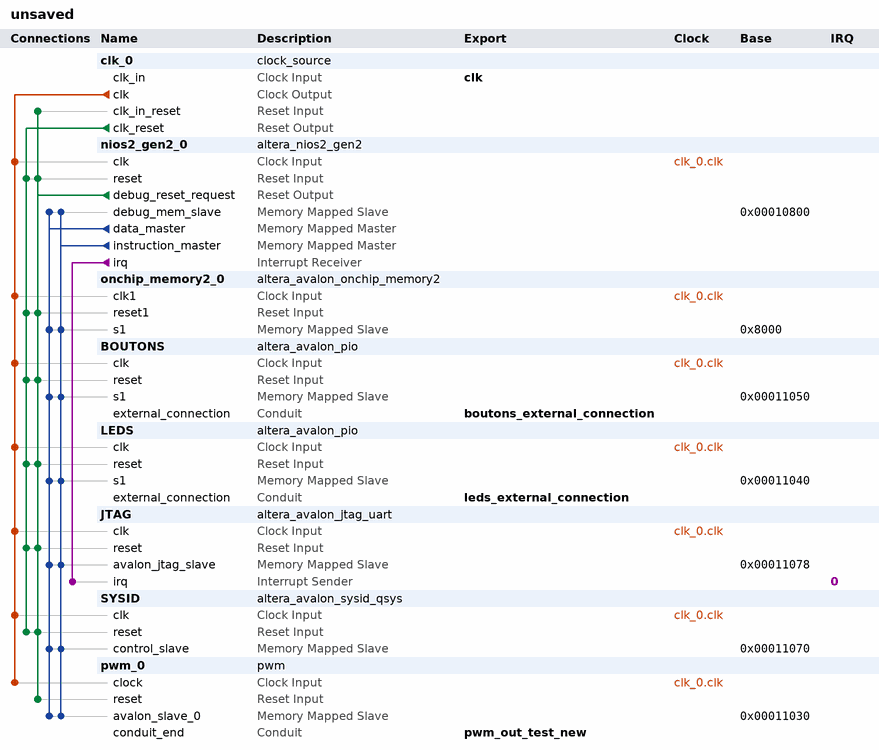
[diagram p0: system contents]
# Platform Designer (Qsys) system unsaved, Cyclone IV E EP4CE22F17C6
# Parameters at their usual value, and those the tool derives, are not listed.
package require -exact qsys 18.1
create_system unsaved
set_project_property DEVICE_FAMILY {Cyclone IV E}
set_project_property DEVICE EP4CE22F17C6

add_instance clk_0 clock_source 18.1
set_instance_parameter_value clk_0 clockFrequency 50000000

add_instance nios2_gen2_0 altera_nios2_gen2 18.1
set_instance_parameter_value nios2_gen2_0 dcache_size 2048
set_instance_parameter_value nios2_gen2_0 exceptionSlave onchip_memory2_0.s1
set_instance_parameter_value nios2_gen2_0 icache_size 4096
set_instance_parameter_value nios2_gen2_0 impl Tiny
set_instance_parameter_value nios2_gen2_0 resetSlave onchip_memory2_0.s1

add_instance onchip_memory2_0 altera_avalon_onchip_memory2 18.1
set_instance_parameter_value onchip_memory2_0 dataWidth 32
set_instance_parameter_value onchip_memory2_0 dualPort false
set_instance_parameter_value onchip_memory2_0 initMemContent true
set_instance_parameter_value onchip_memory2_0 initializationFileName onchip_mem.hex
set_instance_parameter_value onchip_memory2_0 memorySize 20480

add_instance BOUTONS altera_avalon_pio 18.1
set_instance_parameter_value BOUTONS direction Input
set_instance_parameter_value BOUTONS width 2

add_instance LEDS altera_avalon_pio 18.1
set_instance_parameter_value LEDS direction Output
set_instance_parameter_value LEDS width 8

add_instance JTAG altera_avalon_jtag_uart 18.1
set_instance_parameter_value JTAG simInteractiveOptions NO_INTERACTIVE_WINDOWS

add_instance SYSID altera_avalon_sysid_qsys 18.1
set_instance_parameter_value SYSID id 0

add_instance pwm_0 pwm 1.0

# connections
add_connection clk_0.clk BOUTONS.clk clock
add_connection clk_0.clk JTAG.clk clock
add_connection clk_0.clk LEDS.clk clock
add_connection clk_0.clk nios2_gen2_0.clk clock
add_connection clk_0.clk onchip_memory2_0.clk1 clock
add_connection clk_0.clk pwm_0.clock clock
add_connection clk_0.clk SYSID.clk clock
add_connection clk_0.clk_reset BOUTONS.reset reset
add_connection clk_0.clk_reset JTAG.reset reset
add_connection clk_0.clk_reset LEDS.reset reset
add_connection clk_0.clk_reset nios2_gen2_0.reset reset
add_connection clk_0.clk_reset onchip_memory2_0.reset1 reset
add_connection clk_0.clk_reset SYSID.reset reset
add_connection nios2_gen2_0.debug_reset_request BOUTONS.reset reset
add_connection nios2_gen2_0.debug_reset_request clk_0.clk_in_reset reset
add_connection nios2_gen2_0.debug_reset_request JTAG.reset reset
add_connection nios2_gen2_0.debug_reset_request LEDS.reset reset
add_connection nios2_gen2_0.debug_reset_request nios2_gen2_0.reset reset
add_connection nios2_gen2_0.debug_reset_request onchip_memory2_0.reset1 reset
add_connection nios2_gen2_0.debug_reset_request pwm_0.reset reset
add_connection nios2_gen2_0.debug_reset_request SYSID.reset reset
add_connection nios2_gen2_0.data_master BOUTONS.s1 avalon
set_connection_parameter_value nios2_gen2_0.data_master/BOUTONS.s1 baseAddress 0x00011050
add_connection nios2_gen2_0.data_master JTAG.avalon_jtag_slave avalon
set_connection_parameter_value nios2_gen2_0.data_master/JTAG.avalon_jtag_slave baseAddress 0x00011078
add_connection nios2_gen2_0.data_master LEDS.s1 avalon
set_connection_parameter_value nios2_gen2_0.data_master/LEDS.s1 baseAddress 0x00011040
add_connection nios2_gen2_0.data_master nios2_gen2_0.debug_mem_slave avalon
set_connection_parameter_value nios2_gen2_0.data_master/nios2_gen2_0.debug_mem_slave baseAddress 0x00010800
add_connection nios2_gen2_0.data_master onchip_memory2_0.s1 avalon
set_connection_parameter_value nios2_gen2_0.data_master/onchip_memory2_0.s1 baseAddress 0x8000
add_connection nios2_gen2_0.data_master pwm_0.avalon_slave_0 avalon
set_connection_parameter_value nios2_gen2_0.data_master/pwm_0.avalon_slave_0 baseAddress 0x00011030
add_connection nios2_gen2_0.data_master SYSID.control_slave avalon
set_connection_parameter_value nios2_gen2_0.data_master/SYSID.control_slave baseAddress 0x00011070
add_connection nios2_gen2_0.instruction_master BOUTONS.s1 avalon
set_connection_parameter_value nios2_gen2_0.instruction_master/BOUTONS.s1 baseAddress 0x00011050
add_connection nios2_gen2_0.instruction_master JTAG.avalon_jtag_slave avalon
set_connection_parameter_value nios2_gen2_0.instruction_master/JTAG.avalon_jtag_slave baseAddress 0x00011078
add_connection nios2_gen2_0.instruction_master LEDS.s1 avalon
set_connection_parameter_value nios2_gen2_0.instruction_master/LEDS.s1 baseAddress 0x00011040
add_connection nios2_gen2_0.instruction_master nios2_gen2_0.debug_mem_slave avalon
set_connection_parameter_value nios2_gen2_0.instruction_master/nios2_gen2_0.debug_mem_slave baseAddress 0x00010800
add_connection nios2_gen2_0.instruction_master onchip_memory2_0.s1 avalon
set_connection_parameter_value nios2_gen2_0.instruction_master/onchip_memory2_0.s1 baseAddress 0x8000
add_connection nios2_gen2_0.instruction_master pwm_0.avalon_slave_0 avalon
set_connection_parameter_value nios2_gen2_0.instruction_master/pwm_0.avalon_slave_0 baseAddress 0x00011030
add_connection nios2_gen2_0.instruction_master SYSID.control_slave avalon
set_connection_parameter_value nios2_gen2_0.instruction_master/SYSID.control_slave baseAddress 0x00011070
add_connection nios2_gen2_0.irq JTAG.irq interrupt
set_connection_parameter_value nios2_gen2_0.irq/JTAG.irq irqNumber 0

# exported interfaces
add_interface boutons_external_connection conduit end
set_interface_property boutons_external_connection EXPORT_OF BOUTONS.external_connection
add_interface clk clock sink
set_interface_property clk EXPORT_OF clk_0.clk_in
add_interface leds_external_connection conduit end
set_interface_property leds_external_connection EXPORT_OF LEDS.external_connection
add_interface pwm_out_test_new conduit end
set_interface_property pwm_out_test_new EXPORT_OF pwm_0.conduit_end

set_interconnect_requirement {$system} qsys_mm.clockCrossingAdapter HANDSHAKE
set_interconnect_requirement {$system} qsys_mm.enableEccProtection FALSE
set_interconnect_requirement {$system} qsys_mm.insertDefaultSlave FALSE
set_interconnect_requirement {$system} qsys_mm.maxAdditionalLatency 1

save_system unsaved.qsys
